# Altium schematic sheet W5500_C9900112131_2024-08-15.schdoc
size 52 x 37 mm
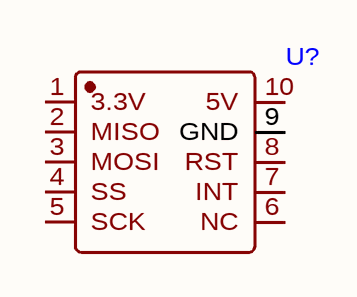
[diagram p0: W5500_C9900112131_2024-08-15.schdoc]

## Parts
U?  (no value)  [COMM-TH_L55.2-W28.0-W5500]

## Nets

Not connected (* = marked no-connect by the designer): U? 1(3.3V) 2(MISO) 3(MOSI) 4(SS) 5(SCK) 6(NC) 7(INT) 8(RST) 9(GND) 10(5V)

## Library data of the parts
U? = W5500_C9900112131